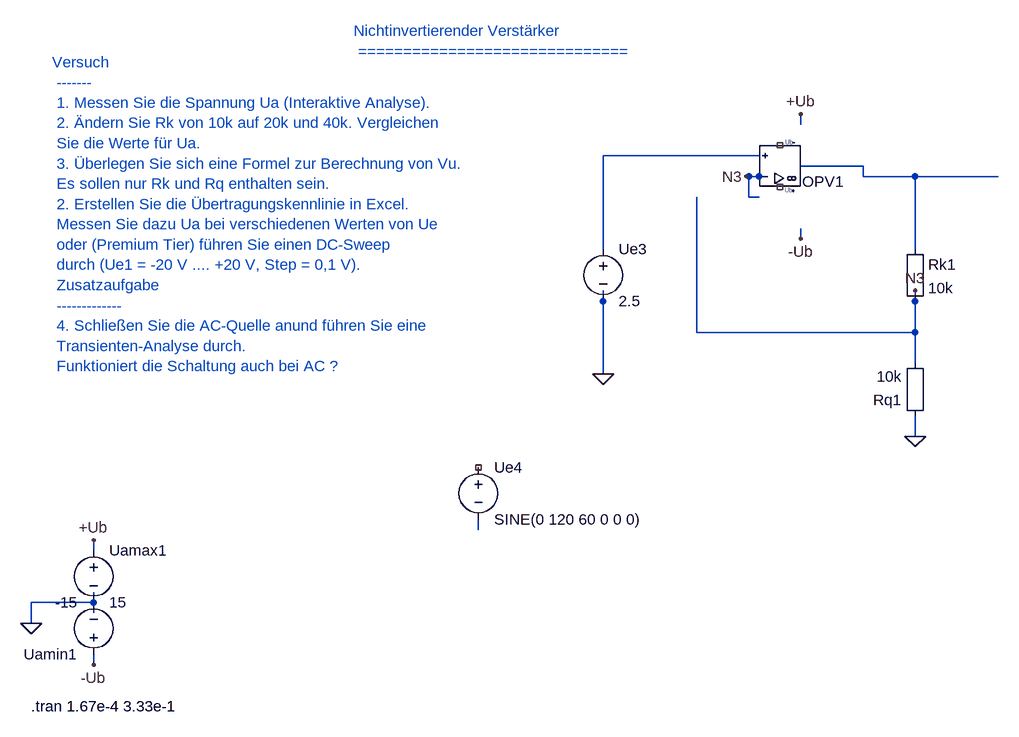
[diagram p0: schematic 1_2_2_Nichtinvertierender_Verstärker.asc]
1_2_2_Nichtinvertierender_Verstärker.asc, the LTspice schematic file:
Version 4
SHEET 1 880 680
WIRE 1184 272 1168 272
WIRE 1168 272 1168 304
WIRE 1168 304 1184 304
WIRE 1248 256 1344 256
WIRE 1344 256 1344 272
WIRE 160 928 160 912
WIRE 160 928 160 944
WIRE 944 464 944 448
WIRE 752 800 752 816
WIRE 160 848 160 832
WIRE 1248 176 1248 192
WIRE 1248 368 1248 352
WIRE 1552 272 1424 272
WIRE 1424 272 1344 272
WIRE 1424 384 1424 272
WIRE 1424 464 1424 512
WIRE 1424 512 1088 512
WIRE 1088 512 1088 304
WIRE 1424 560 1424 512
WIRE 1424 640 1424 672
WIRE 160 928 64 928
WIRE 64 928 64 960
WIRE 160 1008 160 1024
WIRE 944 448 944 576
WIRE 1184 240 944 240
WIRE 944 240 944 384
WIRE 1424 464 1424 448
WIRE 1184 272 1164 272
FLAG 944 576 0
FLAG 64 960 0
FLAG 1424 672 0
FLAG 64 960 0
FLAG 944 576 0
FLAG 1424 672 0
FLAG 1424 448 N3
FLAG 1164 272 N3
FLAG 160 832 +Ub
FLAG 1248 176 +Ub
FLAG 160 1024 -Ub
FLAG 1248 368 -Ub
SYMBOL UniversalOpAmp2 1216 256 M180
SYMATTR InstName OPV1
SYMATTR Value UniversalOpAmp2
SYMBOL voltage 160 832 R0
SYMATTR InstName Uamax1
SYMATTR Value 15
SYMBOL voltage 160 1024 R180
SYMATTR InstName Uamin1
SYMATTR Value -15
SYMBOL voltage 944 368 R0
SYMATTR InstName Ue3
SYMATTR Value 2.5
SYMBOL voltage 752 704 R0
SYMATTR InstName Ue4
SYMATTR Value SINE(0 120 60 0 0 0)
SYMBOL Misc\EuropeanResistor 1408 368 R0
SYMATTR InstName Rk1
SYMATTR Value 10k
SYMBOL Misc\EuropeanResistor 1440 656 R180
SYMATTR InstName Rq1
SYMATTR Value 10k
TEXT 64 1088 Left 2 !.tran 1.67e-4 3.33e-1
TEXT 560 48 Left 2 ;Nichtinvertierender Verstärker \n ==============================
TEXT 96 96 Left 2 ;Versuch \n ------- \n 1. Messen Sie die Spannung Ua (Interaktive Analyse). \n 2. Ändern Sie Rk von 10k auf 20k und 40k. Vergleichen \n Sie die Werte für Ua. \n 3. Überlegen Sie sich eine Formel zur Berechnung von Vu. \n Es sollen nur Rk und Rq enthalten sein. \n 2. Erstellen Sie die Übertragungskennlinie in Excel. \n Messen Sie dazu Ua bei verschiedenen Werten von Ue \n oder (Premium Tier) führen Sie einen DC-Sweep \n durch (Ue1 = -20 V .... +20 V, Step = 0,1 V). \n Zusatzaufgabe \n ------------- \n 4. Schließen Sie die AC-Quelle anund führen Sie eine \n Transienten-Analyse durch. \n Funktioniert die Schaltung auch bei AC ?

The netlist it stands for:
* 1_2_2_Nichtinvertierender_Verstärker.asc
XOPV1 N003 N3 NC_01 NC_02 N001 level2 UniversalOpAmp2 Avol=1Meg GBW=10Meg Slew=10Meg Ilimit=25m Rail=0 Vos=0 En=0 Enk=0 In=0 Ink=0 Rin=500Meg  ; pins In+ In- V+ V- OUT
V§Uamax1 +Ub 0 15
V§Uamin1 -Ub 0 -15
V§Ue3 N003 0 2.5
V§Ue4 NC_03 N002 SINE(0 120 60 0 0 0)
Rk1 N001 N3 10k
Rq1 0 N3 10k
.tran 1.67e-4 3.33e-1
* Nichtinvertierender Verstärker
*  ==============================
* Versuch
*  -------
*  1. Messen Sie die Spannung Ua (Interaktive Analyse).
*  2. Ändern Sie Rk von 10k auf 20k und 40k. Vergleichen
*  Sie die Werte für Ua.
*  3. Überlegen Sie sich eine Formel zur Berechnung von Vu.
*  Es sollen nur Rk und Rq enthalten sein.
*  2. Erstellen Sie die Übertragungskennlinie in Excel.
*  Messen Sie dazu Ua bei verschiedenen Werten von Ue
*  oder (Premium Tier) führen Sie einen DC-Sweep
*  durch (Ue1 = -20 V .... +20 V, Step = 0,1 V).
*  Zusatzaufgabe
*  -------------
*  4. Schließen Sie die AC-Quelle anund führen Sie eine
*  Transienten-Analyse durch.
*  Funktioniert die Schaltung auch bei AC ?
.lib UniversalOpAmp2.lib
.backanno
.end